# EAGLE design digital lockin (EAGLE 9.6.2)

## Sheet 1 of 2
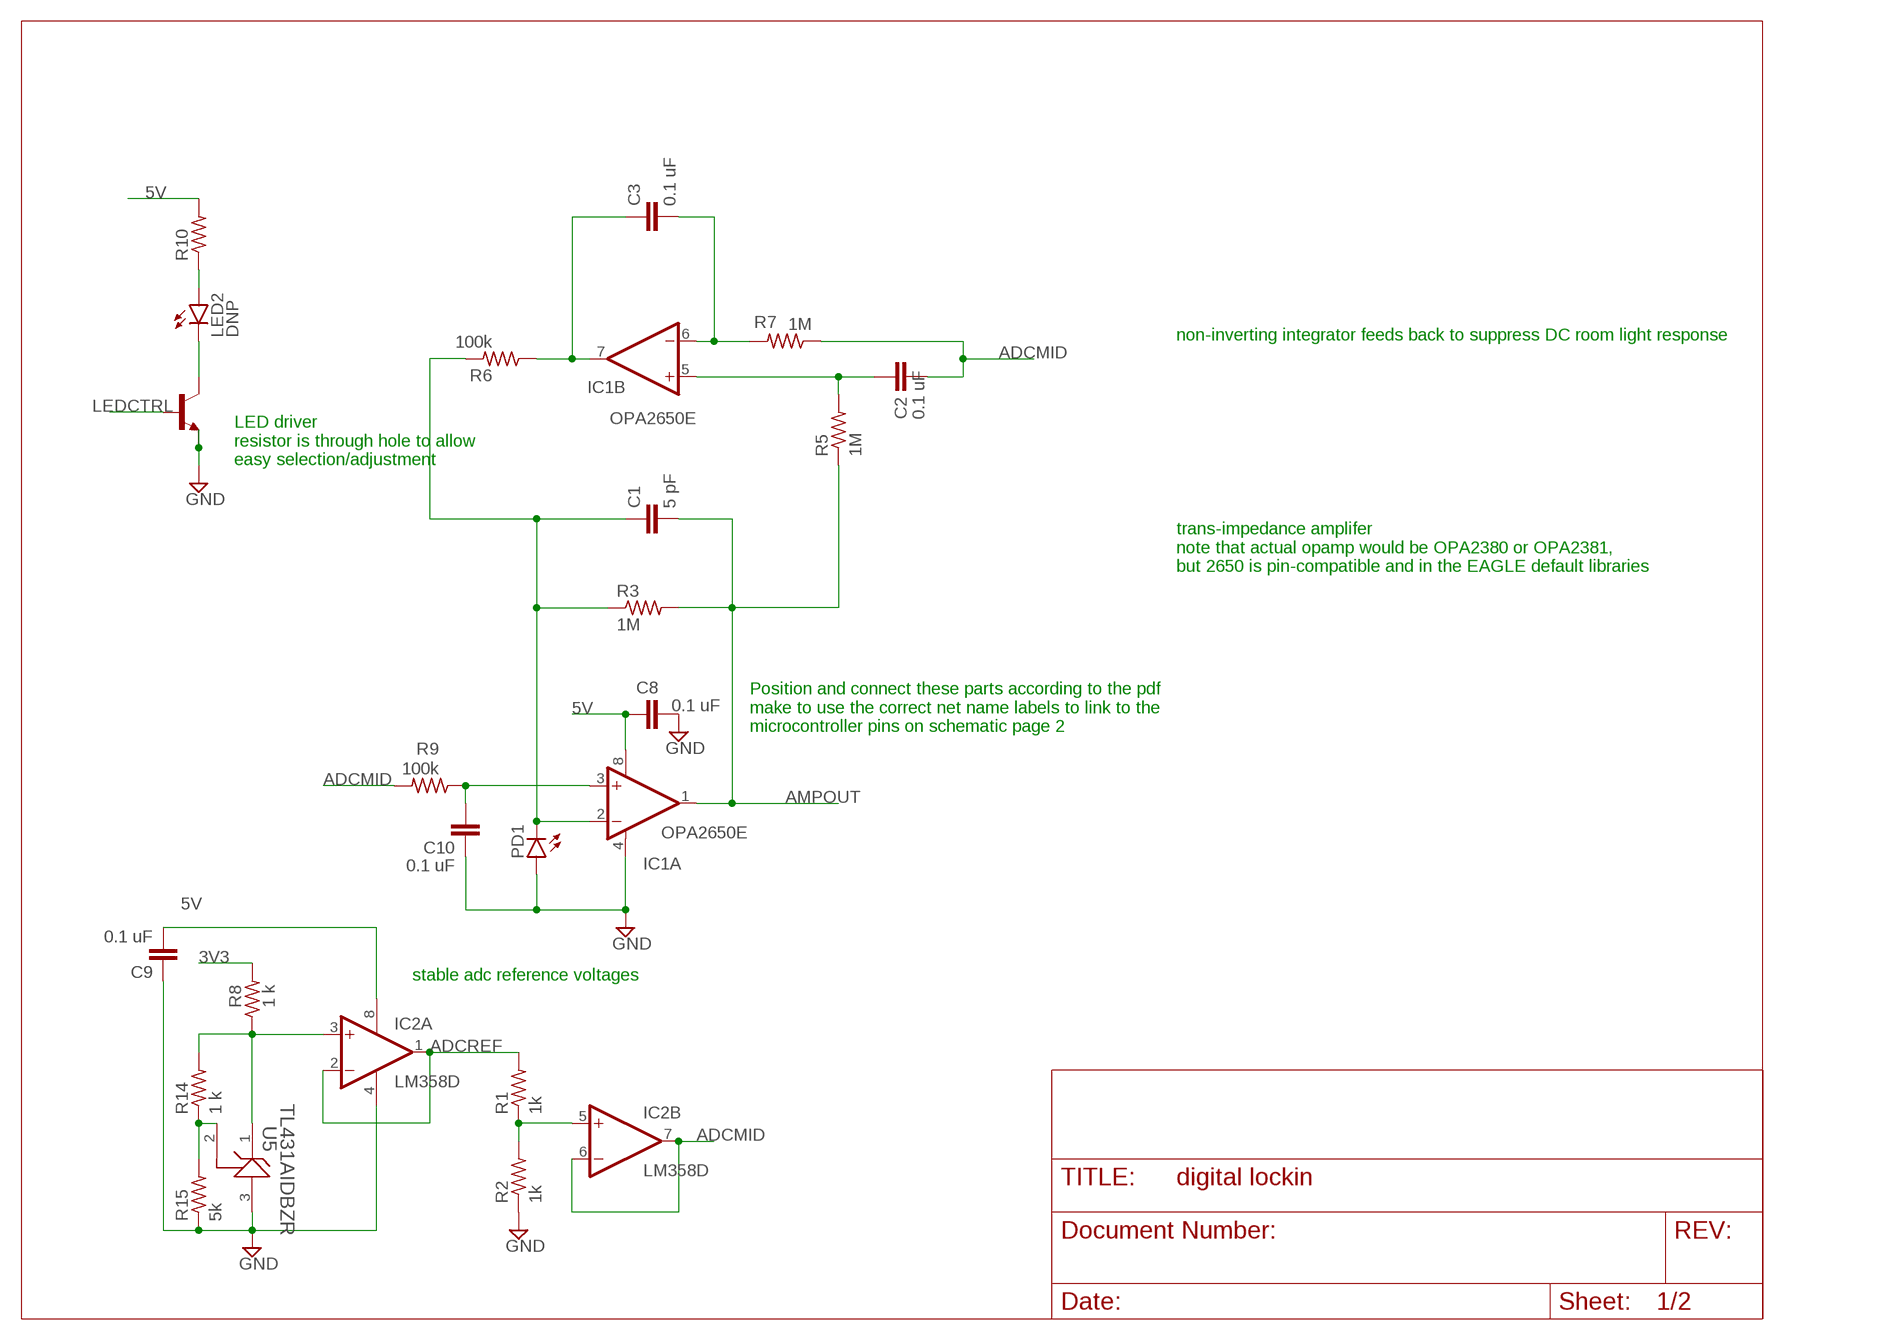
[diagram p0: schematic, sheet 1]

### Parts
C1  5 pF  C-EUC0805  [C0805]
C2  0.1 uF  C-EUC0805  [C0805]
C3  0.1 uF  C-EUC0805  [C0805]
C8  0.1 uF  C-EUC0805  [C0805]
C9  0.1 uF  C-EUC0805  [C0805]
C10  0.1 uF  C-EUC0805  [C0805]
IC1  OPA2650E  [MSOP08]
IC2  LM358D  [SO08]
LED2  DNP  LED5MM  [LED5MM]
PD1  DNP  LED5MM  [LED5MM]
R1  1k  R-US_R0805  [R0805]
R2  1k  R-US_R0805  [R0805]
R3  1M  R-US_R0805  [R0805]
R5  1M  R-US_R0805  [R0805]
R6  100k  R-US_R0805  [R0805]
R7  1M  R-US_R0805  [R0805]
R8  1 k  R-US_R0805  [R0805]
R9  100k  R-US_R0805  [R0805]
R10  DNP  R-US_0204/2V  [0204V]
R14  1 k  R-US_R0805  [R0805]
R15  5k  R-US_R0805  [R0805]
T2  NPN  BC808-NPN-SOT23-BEC  [SOT23-BEC]
U5  TL431AIDBZR  [DBZ0003A_N]

### Nets
3V3 [power]: R8.2 ; also sheet 2
5V [power]: C9.2 IC2.8(P:V+) R10.2 ; also sheet 2
ADCMID: IC2.6(B:-IN) IC2.7(B:OUT) ; also sheet 2
ADCREF: IC2.1(A:OUT) IC2.2(A:-IN) R1.2 ; also sheet 2
GND [power]: C8.2 C9.1 C10.1 IC1.4(A:V-) IC2.4(P:V-) PD1.A R2.1 R15.1 T2.E U5.3(ANODE) ; also sheet 2
LEDCTRL: T2.B ; also sheet 2
N$1: C2.1 IC1.5(B:+IN) R5.2
N$2: C1.1 IC1.2(A:-IN) PD1.K(C) R3.1 R6.2
N$3: LED2.K(C) T2.C
N$4: C2.2 R7.1
N$5: C3.2 IC1.6(B:-IN) R7.2
N$6: C3.1 IC1.7(B:OUT) R6.1
N$7: C1.2 IC1.1(A:OUT) R3.2 R5.1
N$8: C8.1 IC1.8(A:V+)
N$9: IC2.3(A:+IN) R8.1 R14.2 U5.1(CATHODE)
N$10: IC2.5(B:+IN) R1.1 R2.2
N$11: R9.2
N$12: LED2.A R10.1
N$13: C10.2 IC1.3(A:+IN) R9.1
N$20: R14.1 R15.2 U5.2(REF)

### Notes on the sheet
- non-inverting integrator feeds back to suppress DC room light response
- ADCMID
- LED driver
  resistor is through hole to allow 
  easy selection/adjustment
- trans-impedance amplifer
  note that actual opamp would be OPA2380 or OPA2381, 
  but 2650 is pin-compatible and in the EAGLE default libraries
- 5V
- Position and connect these parts according to the pdf
  make to use the correct net name labels to link to the 
  microcontroller pins on schematic page 2
- ADCMID
- AMPOUT
- stable adc reference voltages

## Sheet 2 of 2
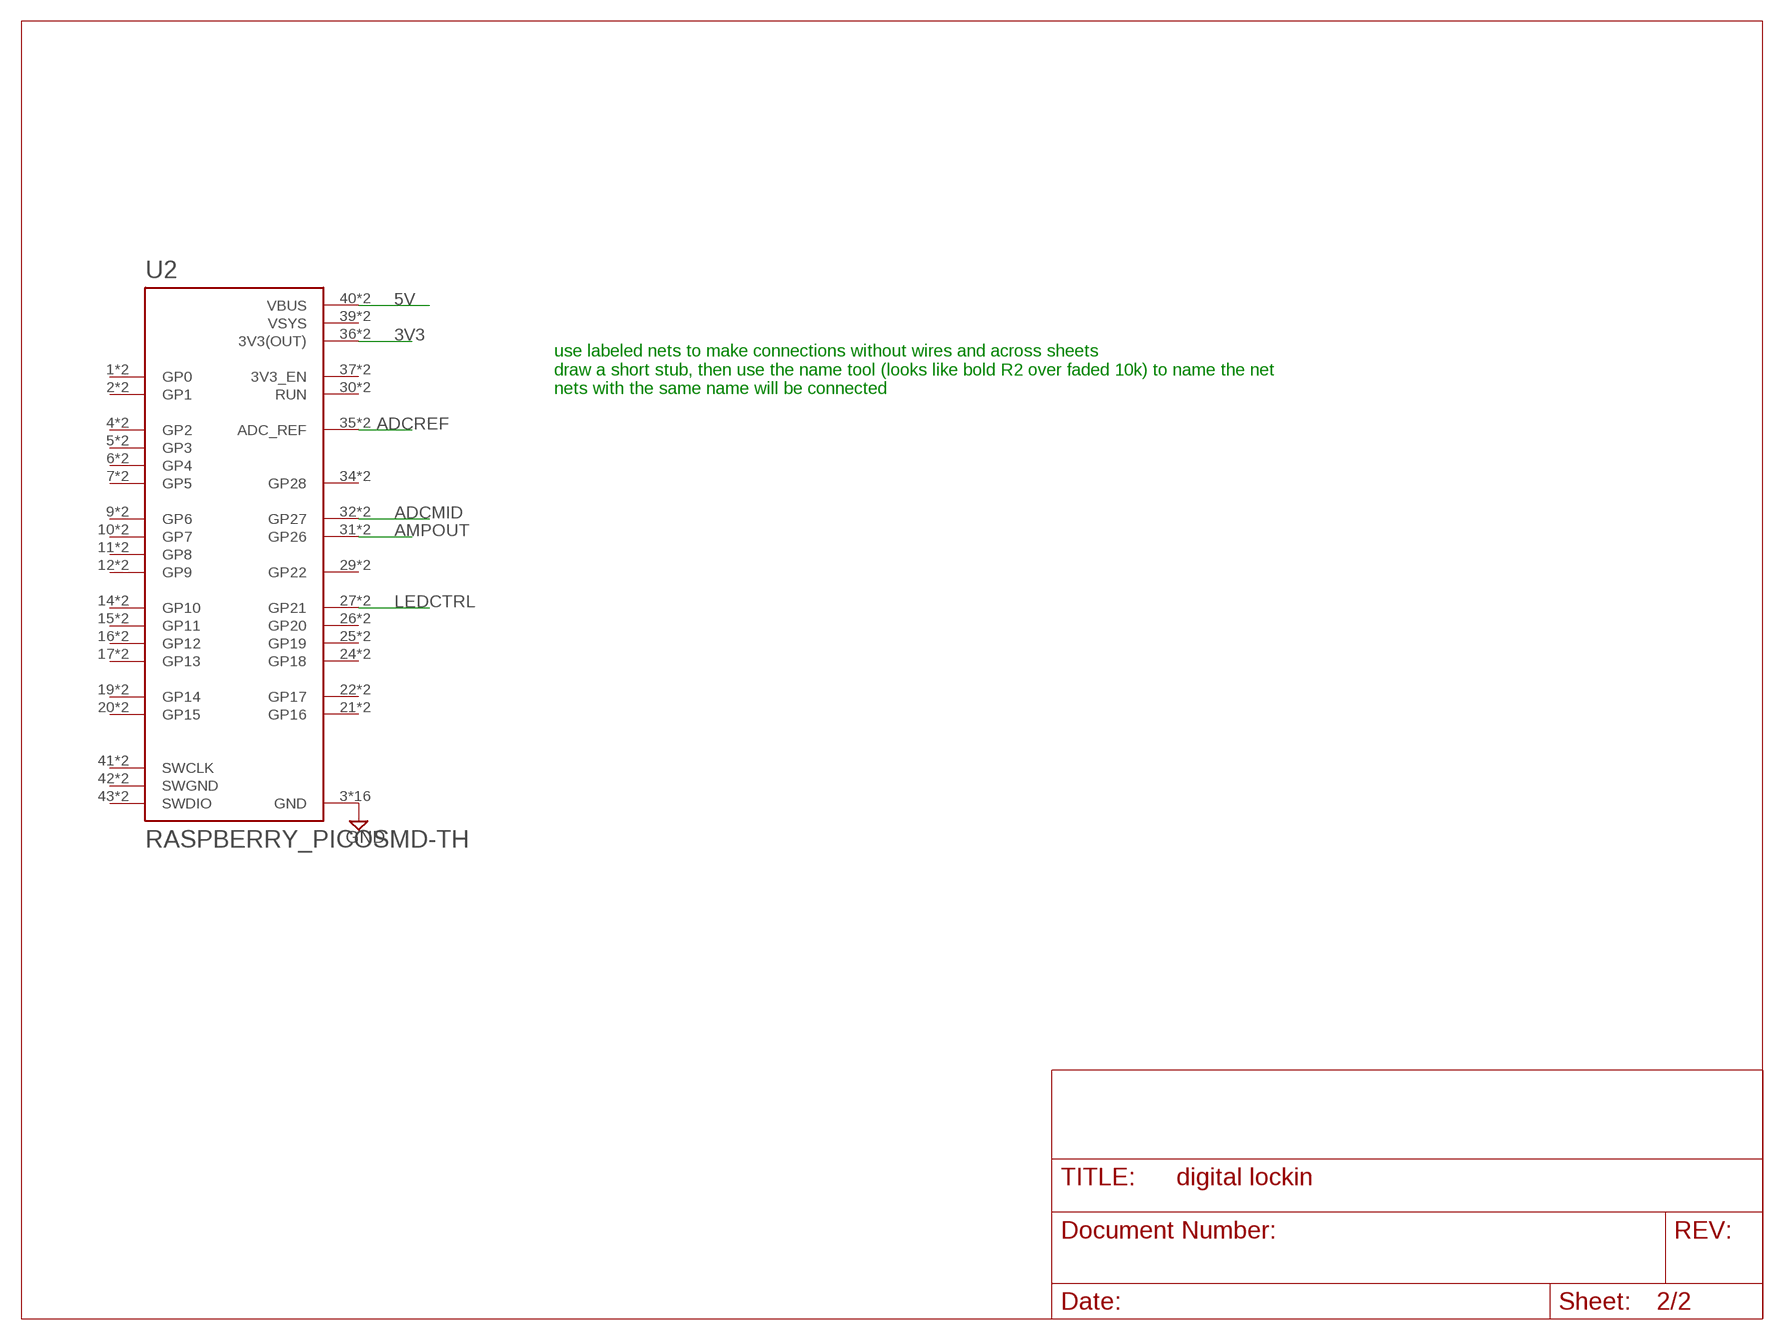
[diagram p1: schematic, sheet 2]

### Parts
U2  RASPBERRY_PICOSMD-TH  [PICO-PKG]

### Nets
3V3 [power]: U2.36(3V3(OUT)) U2.P$36(3V3(OUT)) ; also sheet 1
5V [power]: U2.40(VBUS) U2.P$40(VBUS) ; also sheet 1
ADCMID: U2.32(GP27) U2.P$32(GP27) ; also sheet 1
ADCREF: U2.35(ADC_REF) U2.P$35(ADC_REF) ; also sheet 1
AMPOUT: U2.31(GP26) U2.P$31(GP26)
GND [power]: U2.3(GND) U2.8(GND) U2.13(GND) U2.18(GND) U2.23(GND) U2.28(GND) U2.33(GND) U2.38(GND) U2.P$3(GND) U2.P$8(GND) U2.P$13(GND) U2.P$18(GND) U2.P$23(GND) U2.P$28(GND) U2.P$33(GND) U2.P$38(GND) ; also sheet 1
LEDCTRL: U2.27(GP21) U2.P$27(GP21) ; also sheet 1
Unconnected: U2.1(GP0) U2.2(GP1) U2.4(GP2) U2.5(GP3) U2.6(GP4) U2.7(GP5) U2.9(GP6) U2.10(GP7) U2.11(GP8) U2.12(GP9) U2.14(GP10) U2.15(GP11) U2.16(GP12) U2.17(GP13) U2.19(GP14) U2.20(GP15) U2.21(GP16) U2.22(GP17) U2.24(GP18) U2.25(GP19) U2.26(GP20) U2.29(GP22) U2.30(RUN) U2.34(GP28) U2.37(3V3_EN) U2.41(SWCLK) U2.43(SWDIO) U2.P$1(GP0) U2.P$2(GP1) U2.P$4(GP2) U2.P$5(GP3) U2.P$6(GP4) U2.P$7(GP5) U2.P$9(GP6) U2.P$10(GP7) U2.P$11(GP8) U2.P$12(GP9) U2.P$14(GP10) U2.P$15(GP11) U2.P$16(GP12) U2.P$17(GP13) U2.P$19(GP14) U2.P$20(GP15) U2.P$21(GP16) U2.P$22(GP17) U2.P$24(GP18) U2.P$25(GP19) U2.P$26(GP20) U2.P$29(GP22) U2.P$30(RUN) U2.P$34(GP28) U2.P$37(3V3_EN) U2.P$41(SWCLK) U2.P$43(SWDIO)

### Notes on the sheet
- use labeled nets to make connections without wires and across sheets
  draw a short stub, then use the name tool (looks like bold R2 over faded 10k) to name the net
  nets with the same name will be connected

## Power pins joined to a net without a drawn wire
SWGND: U2.42(SWGND) U2.P$42(SWGND)
VSYS: U2.39(VSYS) U2.P$39(VSYS)

## Library data of the parts
C1 = rcl:C-EU: CAPACITOR, European symbol; SPICEPREFIX: C
C2 C3 C8-C10 = rcl:C-EU: CAPACITOR, European symbol; LCSC_PART#: C28233; SPICEPREFIX: C
IC1 = burr-brown:OPA2650: Dual Wideband, Low Power Voltage Feedback Operational Amplifier; ACTUAL_PART: OPA2381; LCSC_PART#: C181662; OC_FARNELL: unknown; OC_NEWARK: unknown
IC2 = linear:LM358: OP AMP also LM158; LM258; LM2904 Source: http://cache.national.com/ds/LM/LM158.pdf; LCSC_PART#: C7950
LED2 PD1 = led:LED: LED OSRAM: - CHIPLED LG R971, LG N971, LY N971, LG Q971, LY Q971, LO R971, LY R971 LH N974, LH R974 LS Q976, LO Q976, LY Q976 LO Q996 - Hyper CHIPLED LW Q18S LB Q993, LB Q99A, LB R99A - SideLED LS A670, LO A670, LY A670, LG A670, LP A670 LB A673, LV A673, LT A673, LW A673 LH A674 LY A675 LS A676, LA A676, LO A676, LY A676, LW A676 LS A679, LY A679, LG A679 - Hyper Micro SIDELED® LS Y876, LA Y876, LO Y876, LY Y876 LT Y87S - SmartLED LW L88C, LW L88S LB L89C, LB L89S, LG L890 LS L89K, LO L89K, LY L89K LS L896, LA L896, LO L896, LY L896 - TOPLED LS T670, LO T670, LY T670, LG T670, LP T670 LSG T670, LSP T670, LSY T670, LOP T670, LYG T670 LG T671, LOG T671, LSG T671 LB T673, LV T673, LT T673, LW T673 LH T674 LS T676, LA T676, LO T676, LY T676, LB T676, LH T676, LSB T676, LW T676 LB T67C, LV T67C, LT T67C, LS T67K, LO T67K, LY T67K, LW E67C LS E67B, LA E67B, LO E67B, LY E67B, LB E67C, LV E67C, LT E67C LW T67C LS T679, LY T679, LG T679 LS T770, LO T770, LY T770, LG T770, LP T770 LB T773, LV T773, LT T773, LW T773 LH T774 LS E675, LA E675, LY E675, LS T675 LS T776, LA T776, LO T776, LY T776, LB T776 LHGB T686 LT T68C, LB T68C - Hyper Mini TOPLED® LB M676 - Mini TOPLED Santana® LG M470 LS M47K, LO M47K, LY M47K Source: http://www.osram.convergy.de LUXEON: - LUMILED® LXK2-PW12-R00, LXK2-PW12-S00, LXK2-PW14-U00, LXK2-PW14-V00 LXK2-PM12-R00, LXK2-PM12-S00, LXK2-PM14-U00 LXK2-PE12-Q00, LXK2-PE12-R00, LXK2-PE12-S00, LXK2-PE14-T00, LXK2-PE14-U00 LXK2-PB12-K00, LXK2-PB12-L00, LXK2-PB12-M00, LXK2-PB14-N00, LXK2-PB14-P00, LXK2-PB14-Q00 LXK2-PR12-L00, LXK2-PR12-M00, LXK2-PR14-Q00, LXK2-PR14-R00 LXK2-PD12-Q00, LXK2-PD12-R00, LXK2-PD12-S00 LXK2-PH12-R00, LXK2-PH12-S00 LXK2-PL12-P00, LXK2-PL12-Q00, LXK2-PL12-R00 Source: www.luxeon.com KINGBRIGHT: KA-3528ASYC Source: www.kingbright.com
R1 R2 R8 R14 = rcl:R-US_: RESISTOR, American symbol; LCSC_PART#: C17513; SPICEPREFIX: R
R3 R5 R7 = rcl:R-US_: RESISTOR, American symbol; LCSC_PART#: C17514; SPICEPREFIX: R
R6 R9 = rcl:R-US_: RESISTOR, American symbol; LCSC_PART#: C149504; SPICEPREFIX: R
R10 R15 = rcl:R-US_: RESISTOR, American symbol; SPICEPREFIX: R
T2 = transistor:*-NPN-: NPN Transistror BF959 corrected 2008.03.06; LCSC_PART#: C2145
U2 = RpiPico:RASPBERRY_PICO: Raspberry Pi Pico
U5 = tl431:TL431AIDBZR; COPYRIGHT: Copyright (C) 2025 Ultra Librarian. All rights reserved.; LCSC_PART#: C3113; MANUFACTURER_PART_NUMBER: TL431AIDBZR; MFR_NAME: Texas Instruments; REFDES: RefDes; TYPE: TYPE

## Net classes
1 power: width 0.305 mm

## Board
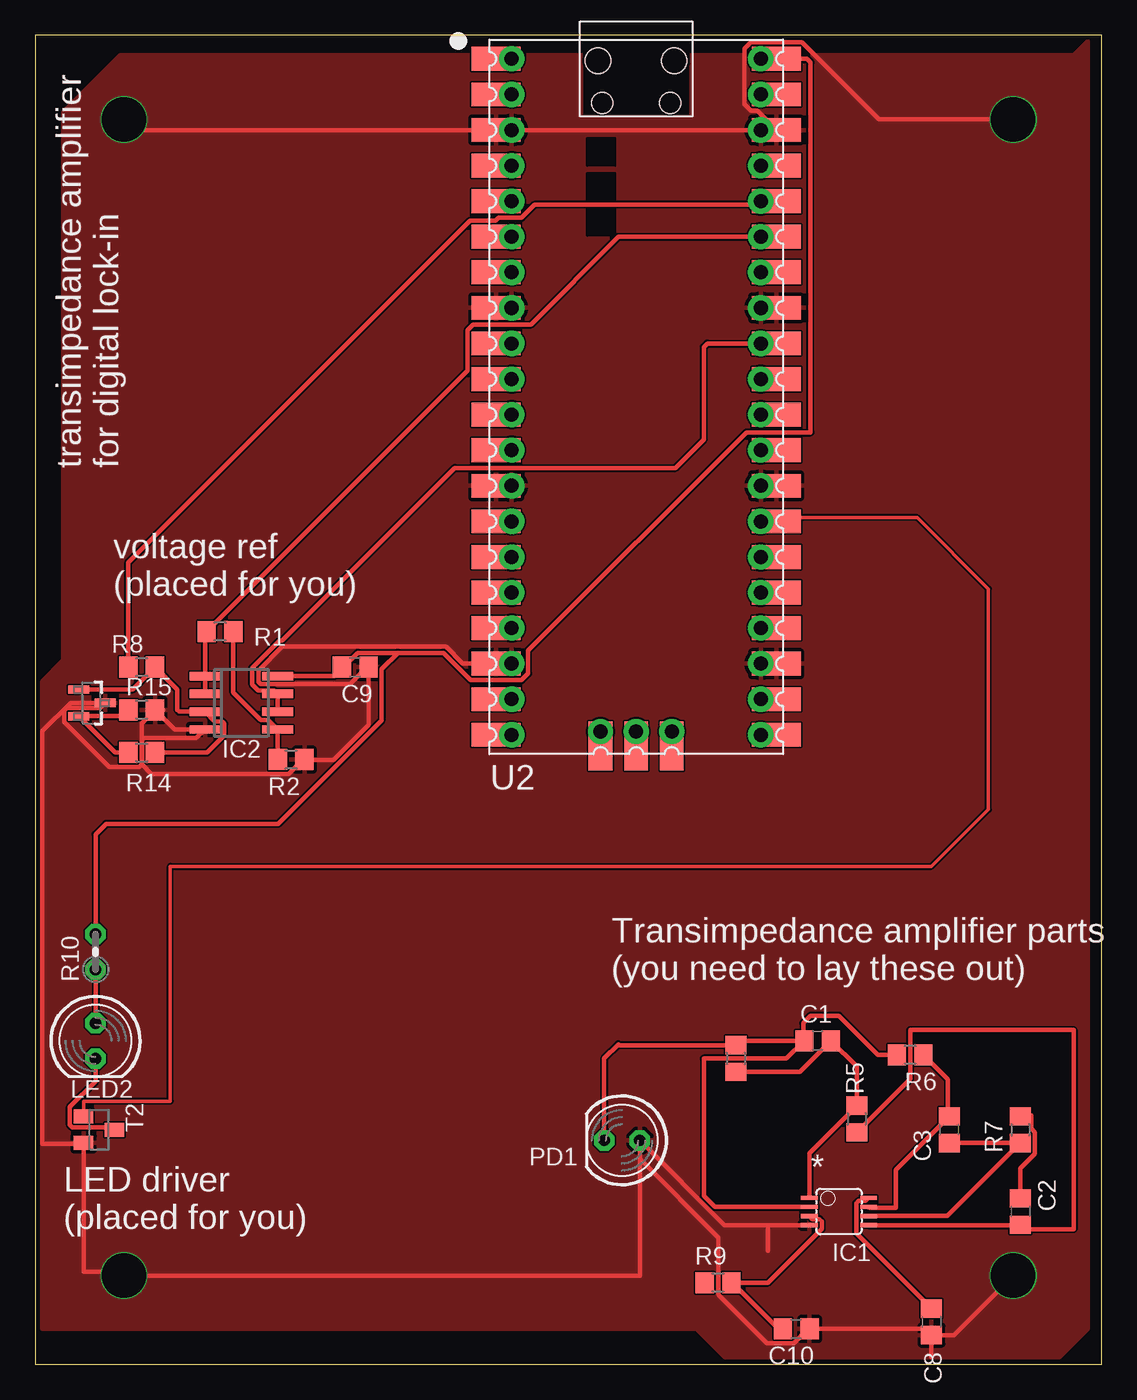
[diagram p2: board, top side]
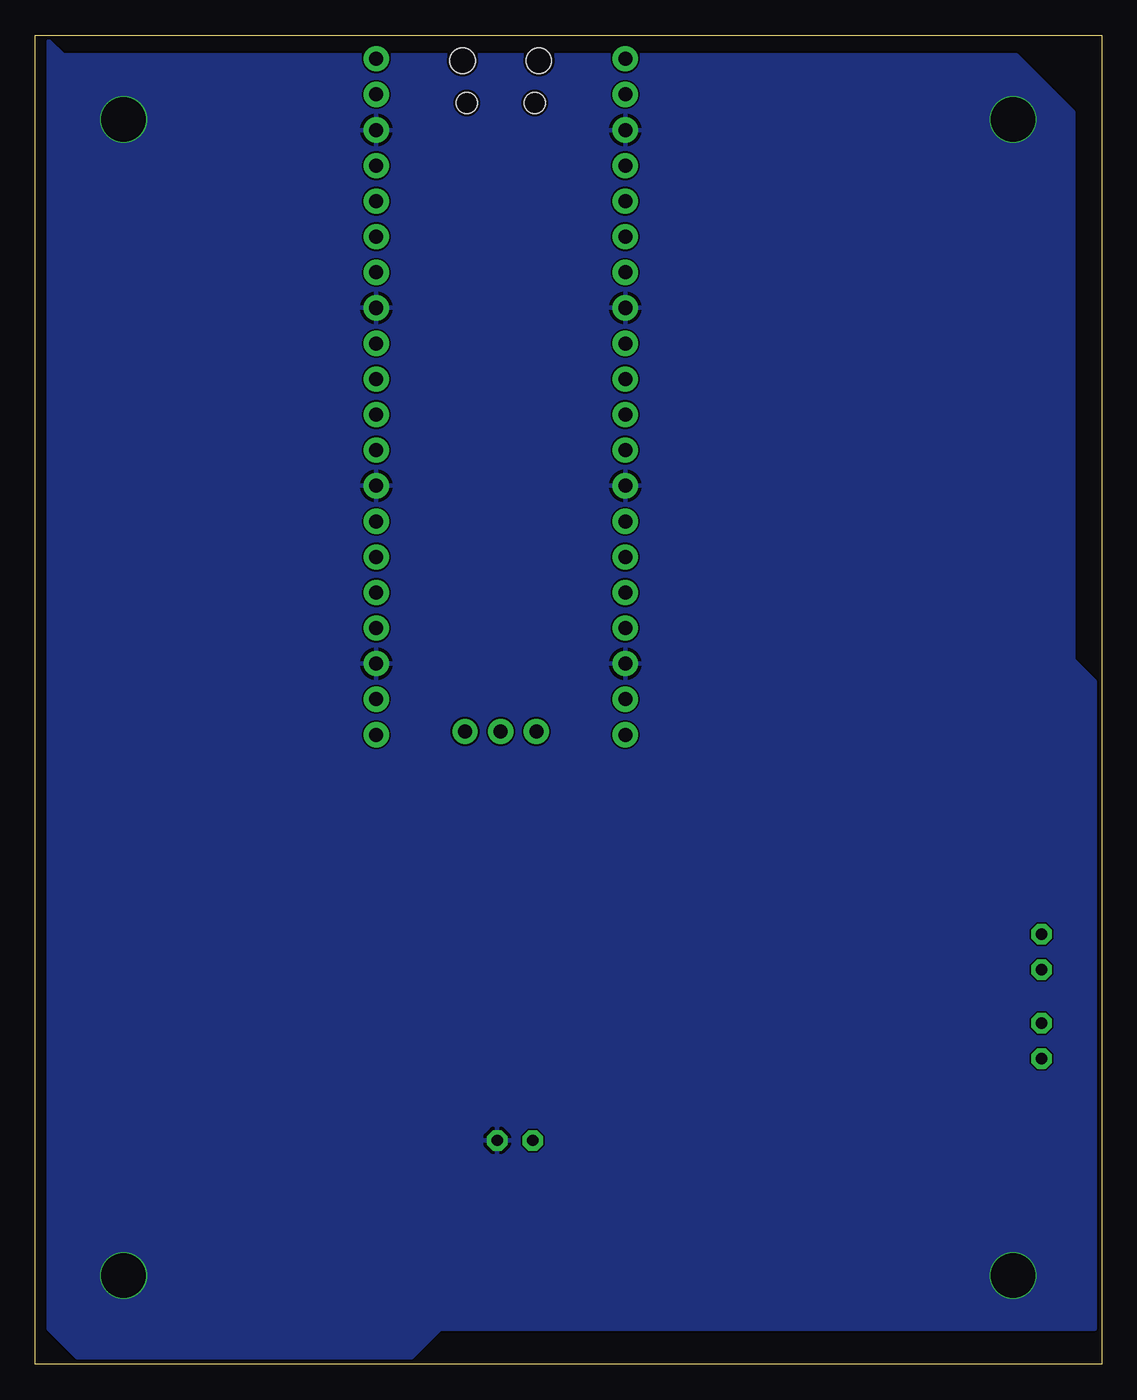
[diagram p3: board, bottom side, seen from below]

Size 76.18 x 94.92 mm. Coordinates in mm from the lower left corner, seen from the top.
Outline: 0,0 76.18,0 76.18,94.92 0,94.92 0,0
Copper layers (1*16): Top 0.035mm / dielectric 1.6mm / Bottom 0.035mm
Design rules "jlcpcb-2layers": minimum track width 5mil, minimum drill 0.3mm, track to track 5mil, track to pad 5mil, pad to pad 5mil, via to via 5mil, smd to smd 5mil, copper to edge 0.2mm, drill to drill 6mil, minimum pad ring 10mil, minimum via ring 3mil, stop-mask expansion 4mil, vias tented up to drill 0mil, thermal gap 10mil

### Footprints (pad centres in the part's own frame; a part is rotated, then mirrored left to right if it is on the bottom)
C0805 = smd 1.3 x 1.5: 1 -0.95,0; 2 0.95,0
MSOP08 = smd 0.3 x 1.2: 1 -0.976,-2.113; 2 -0.326,-2.113; 3 0.324,-2.113; 4 0.974,-2.113; 5 0.974,2.112; 6 0.324,2.112; 7 -0.326,2.112; 8 -0.976,2.112
SO08 = smd 0.6 x 2.2: 1 -1.905,-2.6; 2 -0.635,-2.6; 3 0.635,-2.6; 4 1.905,-2.6; 5 1.905,2.6; 6 0.635,2.6; 7 -0.635,2.6; 8 -1.905,2.6
LED5MM = drill 0.813 octagon: A -1.27,0; K 1.27,0
R0805 = smd 1.3 x 1.5: 1 -0.95,0; 2 0.95,0
0204V = drill 0.813 octagon: 1 -1.27,0; 2 1.27,0
SOT23-BEC = smd 1 x 1.4: B -0.95,-1.1; C 0,1.1; E 0.95,-1.1
PICO-PKG = drill 1: 1 -8.89,24.13; 2 -8.89,21.59; 3 -8.89,19.05; 4 -8.89,16.51; 5 -8.89,13.97; 6 -8.89,11.43; 7 -8.89,8.89; 8 -8.89,6.35; 9 -8.89,3.81; 10 -8.89,1.27; 11 -8.89,-1.27; 12 -8.89,-3.81; 13 -8.89,-6.35; 14 -8.89,-8.89; 15 -8.89,-11.43; 16 -8.89,-13.97; 17 -8.89,-16.51; 18 -8.89,-19.05; 19 -8.89,-21.59; 20 -8.89,-24.13; 21 8.89,-24.13; 22 8.89,-21.59; 23 8.89,-19.05; 24 8.89,-16.51; 25 8.89,-13.97; 26 8.89,-11.43; 27 8.89,-8.89; 28 8.89,-6.35; 29 8.89,-3.81; 30 8.89,-1.27; 31 8.89,1.27; 32 8.89,3.81; 33 8.89,6.35; 34 8.89,8.89; 35 8.89,11.43; 36 8.89,13.97; 37 8.89,16.51; 38 8.89,19.05; 39 8.89,21.59; 40 8.89,24.13; 41 -2.54,-23.9; 42 0,-23.9; 43 2.54,-23.9 | smd 3.5 x 1.7: P$1 -10,24.13; P$2 -10,21.59; P$3 -10,19.05; P$4 -10,16.51; P$5 -10,13.97; P$6 -10,11.43; P$7 -10,8.89; P$8 -10,6.35; P$9 -10,3.81; P$10 -10,1.27; P$11 -10,-1.27; P$12 -10,-3.81; P$13 -10,-6.35; P$14 -10,-8.89; P$15 -10,-11.43; P$16 -10,-13.97; P$17 -10,-16.51; P$18 -10,-19.05; P$19 -10,-21.59; P$20 -10,-24.13; P$21 10,-24.13; P$22 10,-21.59; P$23 10,-19.05; P$24 10,-16.51; P$25 10,-13.97; P$26 10,-11.43; P$27 10,-8.89; P$28 10,-6.35; P$29 10,-3.81; P$30 10,-1.27; P$31 10,1.27; P$32 10,3.81; P$33 10,6.35; P$34 10,8.89; P$35 10,11.43; P$36 10,13.97; P$37 10,16.51; P$38 10,19.05; P$39 10,21.59; P$40 10,24.13 | smd 1.7 x 3.5: P$41 -2.54,-24.925; P$42 0,-24.925; P$43 2.54,-24.925 | hole 1.8: -2.725,24; 2.725,24 | hole 1.5: -2.425,20.97; 2.425,20.97
DBZ0003A_N = smd 1.5 x 0.6: 1 0.95,-0.95; 2 0.95,0.95; 3 -0.95,0

### Placement (x,y rotation side)
C1  55.88,23.11 0 top
C2  70.36,10.92 90 top
C3  65.28,16.76 270 top
C8  64.01,3.05 270 top
C9  22.86,49.78 180 top
C10  54.36,2.54 180 top
IC1  57.4,10.92 270 top
IC2  14.73,47.24 270 top
LED2  4.32,23.11 270 top
PD1  41.91,16 180 top
R1  13.21,52.32 180 top
R2  18.29,43.18 180 top
R3  50.04,21.84 270 top
R5  58.67,17.53 270 top
R6  62.48,22.1 180 top
R7  70.36,16.76 270 top
R8  7.62,49.78 180 top
R9  48.77,5.84 180 top
R10  4.32,29.46 90 top
R14  7.62,43.69 0 top
R15  7.62,46.74 180 top
T2  4.57,16.76 270 top
U2  42.93,69.09 0 top
U5  4.06,47.24 180 top

### Tracks (layer width: path | path; a pad name or v marks a point on that pad's centre or on a via)
3V3
  Top 0.305: R8.2 6.67,57.26 31.06,81.65 32.88,81.65 33.11,81.88 34.74,81.88 35.67,82.8 52.67,82.8 U2.P$36 U2.36
5V
  Top 0.305: U2.P$40 55.12,93.22 55.37,92.96 55.37,66.55 50.8,66.55 35.22,50.96 35.22,49.33 34.74,48.86 31.11,48.86 29.16,50.81 25.91,50.81 | C9.2 21.27,49.15 IC2.8 21.38,49.15 23.04,50.81 25.91,50.81 | 25.91,50.81 24.74,49.65 24.74,45.97 17.38,38.61 5.08,38.61 4.32,37.85 R10.2
ADCMID
  Top 0.305: U2.32 48.01,72.9 47.75,72.64 47.75,66.04 45.72,64.01 29.97,64.01 17.64,51.68 17.45,51.68 15.52,49.74 15.52,48.55 15.94,48.14 17.07,48.14 IC2.7 IC2.6
ADCREF
  Top 0.305: U2.P$35 41.66,80.52 35.4,74.26 31.29,74.26 30.9,73.86 30.9,70.96 R1.2 12.13,52.2 12.13,51.55 IC2.1 IC2.2
GND  (via drill 3.17)
  Top 0.305: T2.E 3.47,15.75 | 3.47,15.75 3.47,6.6 6.35,6.6 v6.35,6.35 43.18,6.35 PD1.A | 12.26,45.21 IC2.4 | 19.3,43.11 19.27,43.15 | 19.27,43.15 R2.1 | 3.47,15.75 0.51,15.75 0.51,45.21 2.54,47.24 U5.3 4.64,46.87 2.25,46.87 2.08,46.71 2.08,45.88 5.3,42.66 7.44,42.66 7.6,42.82 7.6,45.77 R15.1 | v6.35,88.9 7.11,88.14 U2.P$3 52.07,88.14 52.32,87.88 52.58,88.14 U2.P$38 51.56,89.5 51.11,89.5 50.64,89.97 50.64,93.92 51.11,94.4 54.74,94.4 60.24,88.9 v69.85,88.9 | PD1.A 49.23,9.95 51.31,9.95 52.32,9.95 | 52.32,9.95 IC1.4 | C8.2 63.57,2.54 C10.1 55.2,2.54 54.17,1.51 52.25,1.51 48.79,4.98 48.79,9.06 43.18,14.67 PD1.A | C8.2 65.6,2.1 v69.85,6.35 | R15.1 9.14,46.74 | R15.1 9.97,45.34 IC2.4 | 19.27,43.15 19.1,43.15 18.1,42.15 8.31,42.15 7.64,42.82 7.64,44.55 7.8,44.72 11.51,44.72 IC2.4 | 19.27,43.15 21.3,43.15 23.81,45.65 C9.1 23.7,49.78 22.49,48.57 16.12,48.57 15.95,48.73 15.95,49.56 17.63,51.24 29.33,51.24 30.54,50.04 U2.P$18 U2.18 | U2.P$28 U2.28 | U2.P$33 U2.33 | U2.P$8 U2.8 | C8.2 64.01,0.51 | 52.32,9.95 52.32,8.13
  pour Top: 6.1,93.47 2.03,89.41 2.03,50.29 0.51,48.77 0.51,2.54 47.24,2.54 48.77,1.02 49.28,0.51 73.15,0.51 75.18,2.54 75.18,94.49 74.17,93.47
  pour Bottom: 6.1,93.47 74.17,93.47 75.18,94.49 75.18,2.54 73.15,0.51 49.28,0.51 47.24,2.54 29.46,2.54 0.51,2.54 0.51,48.77 2.03,50.29 2.03,89.41
LEDCTRL
  Top 0.254: T2.B 3.47,18.8 9.65,18.8 9.65,35.56 64.01,35.56 68.07,39.62 68.07,55.37 62.99,60.45 52.07,60.45 U2.27
  Top 0.305: U2.P$27 U2.27
N$1
  Top 0.305: IC1.5 70.33,9.95 C2.1 70.68,9.65 74.17,9.65 74.17,23.88 62.48,23.88 62.48,20.39 R5.2
N$2
  Top 0.254: 50.2,22.95 R3.1
  Top 0.305: R6.2 60.2,22.1 57.4,24.89 55.37,24.89 54.86,24.38 54.86,23.18 C1.1 | C1.1 50.36,23.11 50.2,22.95 | R3.1 41.72,22.79 41.66,22.86 40.64,21.84 PD1.K | C1.1 53.66,21.84 47.75,21.84 47.75,12.04 48.55,11.25 IC1.2
N$3
  Top 0.305: T2.C 5.5,16.93 2.66,16.93 2.49,17.1 2.49,18.39 4.32,20.22 LED2.K
N$4
  Top 0.305: C2.2 70.36,14.02 71.39,15.05 71.39,16.58 71.12,16.85 71.12,17.78 70.42,17.78 R7.1
N$5
  Top 0.305: IC1.6 65.14,10.6 R7.2 C3.2
N$6
  Top 0.305: C3.1 65.18,17.62 | 65.18,17.62 61.47,13.9 61.47,11.18 59.59,11.18 IC1.7 | R6.1 65.18,20.35 65.18,17.62
N$7
  Top 0.305: R3.2 54.61,20.89 C1.2 58.67,21.27 R5.1 55.29,15.09 IC1.1
N$8
  Top 0.305: IC1.8 59.3,11.68 58.8,11.68 58.64,11.51 58.64,9.37 C8.1
N$9
  Top 0.305: U5.1 6.98,48.19 R8.1 10.16,48.19 10.16,46.74 10.29,46.61 IC2.3 12.82,45.92 13.35,45.92 13.51,45.76 13.51,44.92 12.28,43.69 R14.2
N$10
  Top 0.305: R2.2 IC2.5 16.64,46.03 16.12,46.03 14.16,47.99 R1.1
N$12
  Top 0.305: R10.1 LED2.A
N$13
  Top 0.305: IC1.3 55.51,10.38 56.01,10.38 56.17,10.21 56.17,9.68 52.33,5.84 49.78,5.84 | R9.1 49.78,5.84 | C10.2 53.09,2.54 49.78,5.84
N$20
  Top 0.305: R14.1 5.72,43.69 U5.2 6.23,46.29 R15.2

### Text on the board
tPlace: TIPS: / turn off the ground airwires / command: ratsnest ! GND / "untangle" the remaining airwires as best you can / (see voltage ref for an example) / pour a ground plane on both sides / (use polygon on top layer(1) and then polygon on bottom layer (16) , type GND for the net name) / then use ripup/visible polygons so you can see what you're doing again / Tools->Autorouter will attempt to route the board automatically / If you do by hand, make one layer horizontal (e.g. top) wires / and one layer (e.g. bottom) vertical wires. / Use the middle mouse button to switch layers while drawing and insert a via automatically / At power supply GND and bypass capacitor grounds, try to make a short stub and then add a via (middle mouse button) / then hit esc to end on the via / this will make a connection to the ground plane on both sides of the board / After you autoroute, type ratsnest to fill the polygons and run a DRC to check for airwires. / Usually these are on the ground plane. / Add vias to ground (see above) where needed and on power supply pins/bypass caps | voltage ref / (placed for you) | Transimpedance amplifier parts / (you need to lay these out) | LED driver / (placed for you) | I have already done this, but to make the autorouter draw thick power wires (so they can carry current), use edit->net classes / to set the power nets and then rules to say a minimum width (here 12)
tNames: transimpedance amplifier / for digital lock-in | *